# Altium project zjb.PrjPcb
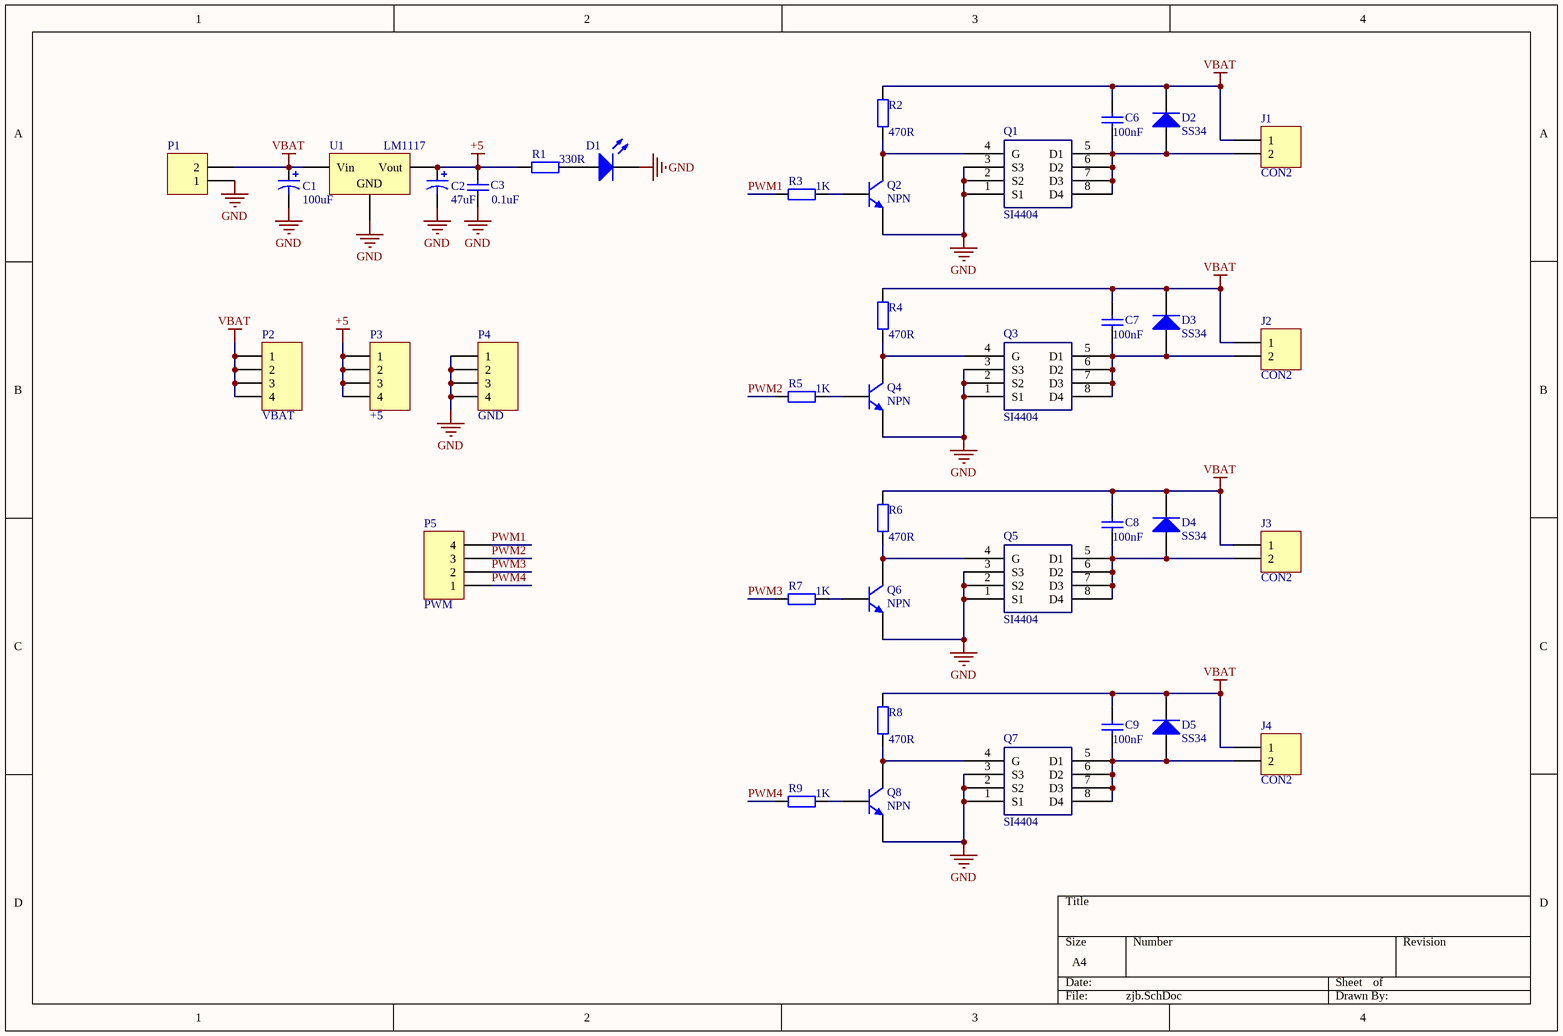
[diagram p0: zjb.SchDoc]
1 sheet, 39 parts. Net scope: global (net labels, ports and power ports of the same name join across sheets).
Board file: zjb.PcbDoc

## Sheet zjb.SchDoc
size A4

### Parts
C1  value 100uF  [C0805]  (hidden comment: Cap Pol3)
C2  value 47uF  [C0805]  (hidden comment: Cap Pol3)
C3  value 0.1uF  [C0805]  (hidden comment: Cap)
C6  value 100nF  [C0805]  (hidden comment: Cap)
C7  value 100nF  [C0805]  (hidden comment: Cap)
C8  value 100nF  [C0805]  (hidden comment: Cap)
C9  value 100nF  [C0805]  (hidden comment: Cap)
D1  LED1  [6-0805]  (value not drawn)
D2  SS34  [SMB]
D3  SS34  [SMB]
D4  SS34  [SMB]
D5  SS34  [SMB]
J1  CON2  [HDR1X2]
J2  CON2  [HDR1X2]
J3  CON2  [HDR1X2]
J4  CON2  [HDR1X2]
P1  Header 2  [HDR1X2]  (value not drawn)
P2  VBAT  [HDR1X4]
P3  +5  [HDR1X4]
P4  GND  [HDR1X4]
P5  PWM  [HDR1X4]
Q1  SI4404  [SO8]
Q2  NPN  [SOT-23]
Q3  SI4404  [SO8]
Q4  NPN  [SOT-23]
Q5  SI4404  [SO8]
Q6  NPN  [SOT-23]
Q7  SI4404  [SO8]
Q8  NPN  [SOT-23]
R1  value 330R  [6-0805]  (hidden comment: Res2)
R2  value 470R  [6-0805]  (hidden comment: Res2)
R3  value 1K  [6-0805]  (hidden comment: Res2)
R4  value 470R  [6-0805]  (hidden comment: Res2)
R5  value 1K  [6-0805]  (hidden comment: Res2)
R6  value 470R  [6-0805]  (hidden comment: Res2)
R7  value 1K  [6-0805]  (hidden comment: Res2)
R8  value 470R  [6-0805]  (hidden comment: Res2)
R9  value 1K  [6-0805]  (hidden comment: Res2)
U1  LM1117  [SOT223]

### Nets
+5: C2.1 C3.2 P3.1 P3.2 P3.3 P3.4 R1.1 U1.3(Vout)
GND: C1.2 C2.2 C3.1 D1.2(K) P1.1 P4.1 P4.2 P4.3 P4.4 Q1.1(S1) Q1.2(S2) Q1.3(S3) Q2.1(E) Q3.1(S1) Q3.2(S2) Q3.3(S3) Q4.1(E) Q5.1(S1) Q5.2(S2) Q5.3(S3) Q6.1(E) Q7.1(S1) Q7.2(S2) Q7.3(S3) Q8.1(E) U1.2(GND)
VBAT: C1.1 C6.2 C7.2 C8.2 C9.2 D2.2(K) D3.2(K) D4.2(K) D5.2(K) J1.1 J2.1 J3.1 J4.1 P1.2 P2.1 P2.2 P2.3 P2.4 R2.2 R4.2 R6.2 R8.2 U1.1(Vin)
PWM1: P5.4 R3.1
PWM2: P5.3 R5.1
PWM3: P5.2 R7.1
PWM4: P5.1 R9.1
NetC6_1: C6.1 D2.1(A) J1.2 Q1.5(D1) Q1.6(D2) Q1.7(D3) Q1.8(D4)
NetC7_1: C7.1 D3.1(A) J2.2 Q3.5(D1) Q3.6(D2) Q3.7(D3) Q3.8(D4)
NetC8_1: C8.1 D4.1(A) J3.2 Q5.5(D1) Q5.6(D2) Q5.7(D3) Q5.8(D4)
NetC9_1: C9.1 D5.1(A) J4.2 Q7.5(D1) Q7.6(D2) Q7.7(D3) Q7.8(D4)
NetD1_1: D1.1(A) R1.2
NetQ1_4: Q1.4(G) Q2.3(C) R2.1
NetQ2_2: Q2.2(B) R3.2
NetQ3_4: Q3.4(G) Q4.3(C) R4.1
NetQ4_2: Q4.2(B) R5.2
NetQ5_4: Q5.4(G) Q6.3(C) R6.1
NetQ6_2: Q6.2(B) R7.2
NetQ7_4: Q7.4(G) Q8.3(C) R8.1
NetQ8_2: Q8.2(B) R9.2

### Library data of the parts
C1 C2 = Cap Pol3: Polarized Capacitor (Surface Mount); Published: 8-Jun-2000; LatestRevisionDate: 17-Jul-2002; LatestRevisionNote: Re-released for DXP Platform.; PackageReference: C0805; Publisher: Altium Limited
C3 C6-C9 = Cap: Capacitor; Published: 8-Jun-2000; LatestRevisionDate: 17-Jul-2002; LatestRevisionNote: Re-released for DXP Platform.; PackageReference: RAD-0.3; Publisher: Altium Limited
D1 = LED0: Typical INFRARED GaAs LED; Published: 8-Jun-2000; LatestRevisionDate: 08-Jul-2005; LatestRevisionNote: Mech Layer 1 removed.; PackageReference: LED-0; Publisher: Altium Limited
D2-D5 = Diode: Default Diode; Published: 8-Jun-2000; LatestRevisionDate: 17-Jul-2002; LatestRevisionNote: Re-released for DXP Platform.; PackageDocument: Sep-1996; PackageReference: SMC; Publisher: Altium Limited; Code_JEDEC: DO-214-AB
J1-J4 P1 = Header 2: Header, 2-Pin; LatestRevisionDate: 17-Jul-2002; LatestRevisionNote: Re-released for DXP Platform.; Publisher: Altium Limited
P2-P5 = Header 4: Header, 4-Pin; LatestRevisionDate: 17-Jul-2002; LatestRevisionNote: Re-released for DXP Platform.; Publisher: Altium Limited
Q1 Q3 Q5 Q7 = Component_1
Q2 Q4 Q6 Q8 = 2N3904: NPN General Purpose Amplifier; Published: 8-Jun-2000; LatestRevisionDate: 15-Jan-2003; LatestRevisionNote: PCB Footprint 'BCY-W3/D4.7' replaced; DatasheetDocument: 1997; PackageDocument: Sep-1998; PackageReference: TO-92A; Publisher: Altium Limited; Code_JEDEC: TO-92A; ComponentLink1Description: Manufacturer Link; ComponentLink1URL: http://www.fairchildsemi.com/; ComponentLink2Description: Datasheet; ComponentLink2URL: http://www.fairchildsemi.com/ds/2N%2F2N3904.pdf
R1-R9 = Res2: Resistor; Published: 8-Jun-2000; LatestRevisionDate: 17-Jul-2002; LatestRevisionNote: Re-released for DXP Platform.; PackageReference: AXIAL-0.4; Publisher: Altium Limited
U1 = Volt Reg: Voltage Regulator; Published: 24-Mar-1999; LatestRevisionDate: 17-Jul-2002; LatestRevisionNote: Re-released for DXP Platform.; PackageReference: D2PAK; Publisher: Altium Limited; Code_JEDEC: SMD-220